# Altium schematic sheet Metroband 1.1 with changes - Sheet1.SchDoc: MetroBand - Main Circuit
size 292 x 193 mm; Title2: MetroBand; ENG_APP_DATE: --/--/--; DSN_APP_DATE: --/--/--; CHK_APP_DATE: --/--/--; Organization: team MOSFETS; Revision: 1.3; SheetNumber: 3; SheetTotal: 3
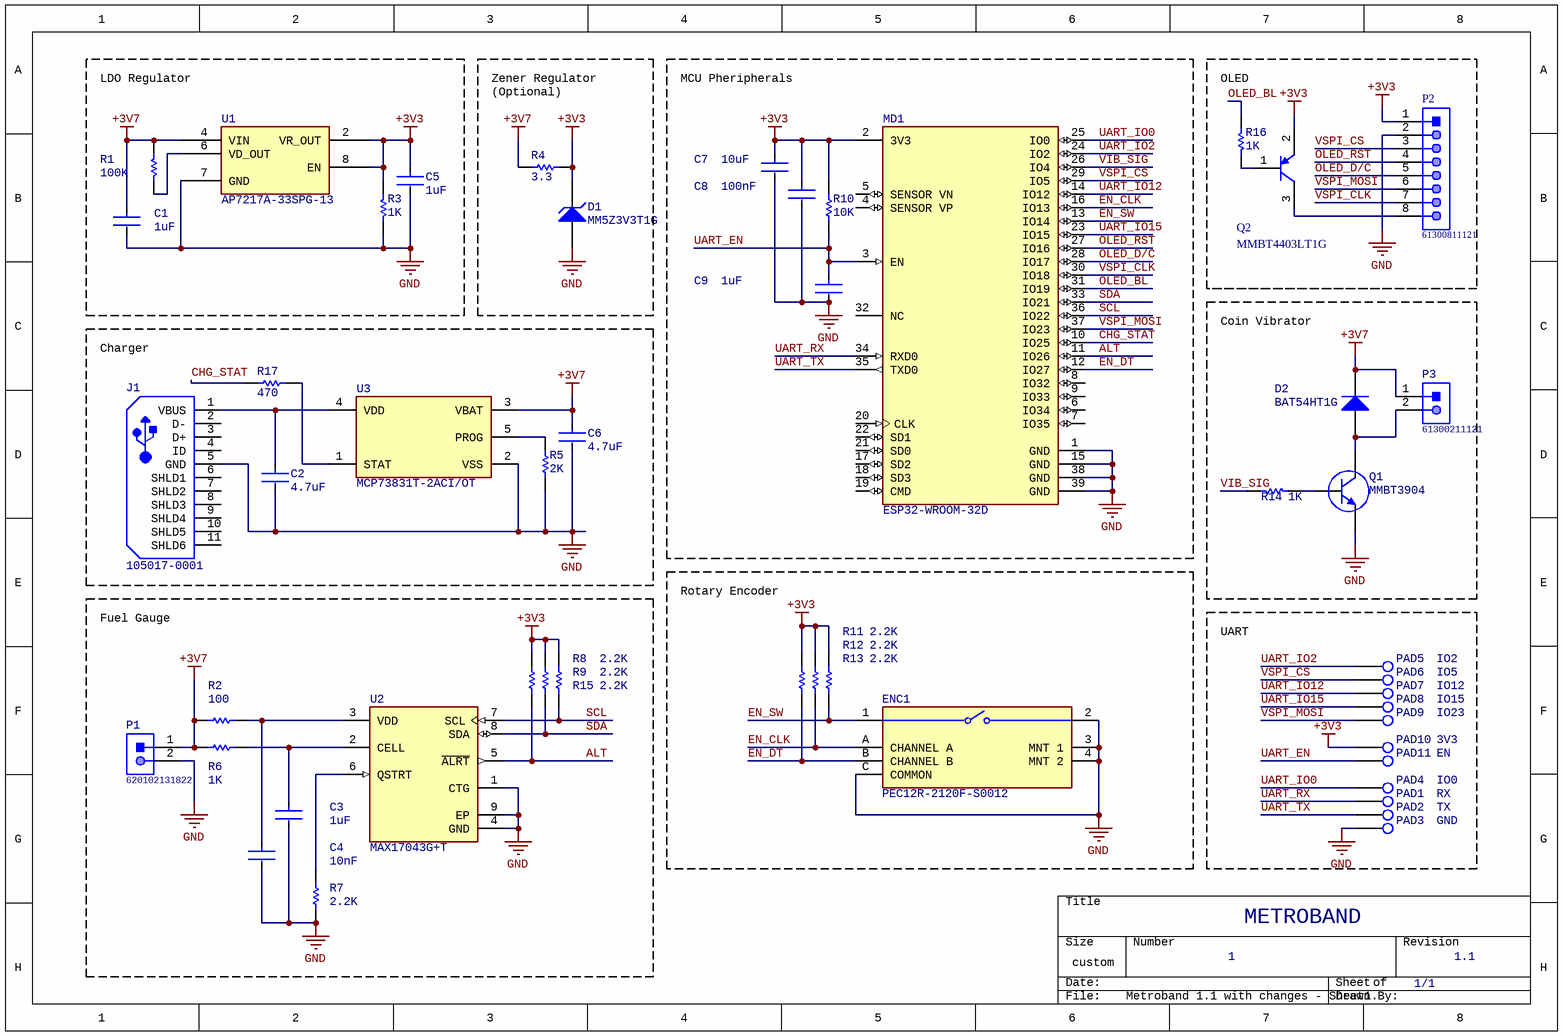
[diagram p0: Metroband 1.1 with changes - Sheet1.SchDoc]

## Parts
C1  1uF  [FP-GRM21B-0_15-IPC_C]
C2  4.7uF  [FP-GRM21B-0_15-IPC_C]
C3  1uF  [FP-GRM21B-0_15-IPC_C]
C4  10nF  [FP-GRM21B-0_15-IPC_C]
C5  1uF  [FP-GRM21B-0_15-IPC_C]
C6  4.7uF  [FP-GRM21B-0_15-IPC_C]
C7  10uF  [FP-GRM21B-0_15-IPC_C]
C8  100nF  [FP-GRM21B-0_15-IPC_C]
C9  1uF  [FP-GRM21B-0_15-IPC_C]
D1  MM5Z3V3T1G  [ONSC-SOD-523-2-502-01_V]
D2  BAT54HT1G  [ONSC-SOD-323-2-477-02_V]
ENC1  PEC12R-2120F-S0012  [FP-PEC12R-2120F-S0012-MFG]
J1  105017-0001  [USB-MICRO-B_V]
MD1  ESP32-WROOM-32D  [FP-ESP32-WROOM-32D-MFG]
P1  620102131822  [620102131822]
P2  61300811121  [61300811121]
P3  61300211121  [61300211121]
PAD1  RX  [PAD-Footprint-1]
PAD2  TX  [PAD-Footprint-1]
PAD3  GND  [PAD-Footprint-1]
PAD4  IO0  [PAD-Footprint-1]
PAD5  IO2  [PAD-Footprint-1]
PAD6  IO5  [PAD-Footprint-1]
PAD7  IO12  [PAD-Footprint-1]
PAD8  IO15  [PAD-Footprint-1]
PAD9  IO23  [PAD-Footprint-1]
PAD10  3V3  [PAD-Footprint-1]
PAD11  EN  [PAD-Footprint-1]
Q1  MMBT3904  [NXP-SOT23-3_V]
Q2  MMBT4403LT1G  [ONSC-SOT-23-3-318-08_V]
R1  100K  [RESC1609X50X30NL8T20]
R2  100  [RESC1609X50X30NL8T20]
R3  1K  [RESC1609X50X30NL8T20]
R4  3.3  [RESC1609X50X30NL8T20]
R5  2K  [RESC1609X50X30NL8T20]
R6  1K  [RESC1609X50X30NL8T20]
R7  2.2K  [RESC1609X50X30NL8T20]
R8  2.2K  [RESC1609X50X30NL8T20]
R9  2.2K  [RESC1609X50X30NL8T20]
R10  10K  [RESC1609X50X30NL8T20]
R11  2.2K  [RESC1609X50X30NL8T20]
R12  2.2K  [RESC1609X50X30NL8T20]
R13  2.2K  [RESC1609X50X30NL8T20]
R14  1K  [RESC1609X50X30NL8T20]
R15  2.2K  [RESC1609X50X30NL8T20]
R16  1K  [RESC1609X50X30NL8T20]
R17  470  [RESC1609X50X30NL8T20]
U1  AP7217A-33SPG-13  [AP7217A-33SPG-13-Footprint-1]
U2  MAX17043G+T  [FP-T823-1-MFG]
U3  MCP73831T-2ACI/OT  [FP-C04-091-OT-IPC_A]

## Blocks framed on the sheet
LDO Regulator: C1 C5 R1 R3 U1
MCU Pheripherals: C7-C9 MD1 R10
Coin Vibrator: D2 P3 Q1 R14
Charger: C2 C6 J1 R5 R17 U3
Fuel Gauge: C3 C4 P1 R2 R6-R9 R15 U2
Rotary Encoder: ENC1 R11-R13
UART: PAD1-PAD11

## Nets
+3V3: C5.1 C7.1 C8.1 D1.1(K) MD1.2(3V3) P2.1 PAD10.1 Q2.2(E) R3.2 R4.2 R8.2 R9.2 R10.2 R11.2 R12.2 R13.2 R15.2 U1.2(VR_OUT) U1.8(EN)
+3V7: C1.1 C6.1 D2.1(K) P1.1 P3.1 R1.2 R2.2 R4.1 R6.2 U1.4(VIN) U3.3(VBAT)
GND: C1.2 C2.2 C3.2 C4.2 C5.2 C6.2 C7.2 C8.2 C9.2 D1.2(A) ENC1.2 ENC1.3(MNT_1) ENC1.4(MNT_2) ENC1.C(COMMON) J1.5(GND) MD1.1(GND) MD1.15(GND) MD1.38(GND) MD1.39(GND) P1.2 P2.2 PAD3.1 Q1.2(E) R3.1 R5.1 R7.1 U1.7(GND) U2.1(CTG) U2.4(GND) U2.9(EP) U3.2(VSS)
ALT: MD1.11(IO26) R8.1 U2.5(~{ALRT})
CHG_STAT: MD1.10(IO25) R17.2
EN_CLK: ENC1.A(CHANNEL_A) MD1.16(IO13) R12.1
EN_DT: ENC1.B(CHANNEL_B) MD1.12(IO27) R11.1
EN_SW: ENC1.1 MD1.13(IO14) R13.1
OLED_BL: MD1.31(IO19) R16.2
OLED_D/C: MD1.28(IO17) P2.5
OLED_RST: MD1.27(IO16) P2.4
SCL: MD1.36(IO22) R15.1 U2.7(SCL)
SDA: MD1.33(IO21) R9.1 U2.8(SDA)
UART_EN: C9.1 MD1.3(EN) PAD11.1 R10.1
UART_IO0: MD1.25(IO0) PAD4.1
UART_IO2: MD1.24(IO2) PAD5.1
UART_IO12: MD1.14(IO12) PAD7.1
UART_IO15: MD1.23(IO15) PAD8.1
UART_RX: MD1.34(RXD0) PAD1.1
UART_TX: MD1.35(TXD0) PAD2.1
VIB_SIG: MD1.26(IO4) R14.2
VSPI_CLK: MD1.30(IO18) P2.7
VSPI_CS: MD1.29(IO5) P2.3 PAD6.1
VSPI_MOSI: MD1.37(IO23) P2.6 PAD9.1
NetC2_1: C2.1 J1.1(VBUS) U3.4(VDD)
NetC3_1: C3.1 R6.1 U2.2(CELL)
NetC4_1: C4.1 R2.1 U2.3(VDD)
NetD2_2: D2.2(A) P3.2 Q1.3(C)
NetP2_8: P2.8 Q2.3(C)
NetQ1_1: Q1.1(B) R14.1
NetQ2_1: Q2.1(B) R16.1
NetR1_1: R1.1 U1.6(VD_OUT)
NetR5_2: R5.2 U3.5(PROG)
NetR7_2: R7.2 U2.6(QSTRT)
NetR17_1: R17.1 U3.1(STAT)

Not connected (* = marked no-connect by the designer): J1 2(D-) 3(D+) 4(ID) 6(SHLD1) 7(SHLD2) 8(SHLD3) 9(SHLD4) 10(SHLD5) 11(SHLD6); MD1 4(SENSOR_VP) 5(SENSOR_VN) 6(IO34) 7(IO35) 8(IO32) 9(IO33) 17(SD2) 18(SD3) 19(CMD) 20(CLK) 21(SD0) 22(SD1) 32(NC)

## Notes on the sheet
- Zener Regulator
- (Optional)
- (near R16) OLED
- 1
- METROBAND
- 1/1
- 1.1
- THIS DOCUMENT AND THE DATA DISCLOSED HEREIN OR
- HEREWITH IS THE PROPERTY OF ALTIUM LIMITED AND MAY
- DWG NO:
- REVISION
- REV:
- DESCRIPTION
- DATE
- APPROVED
- BE FREELY DISTRIBUTED IN WHOLE. NO RIGHTS ARE
- RESERVED OR EXPRESS OR IMPLIED WARANTEE GIVEN.
- ENG:
- APPROVALS
- PROJECT
- DSN:
- CHK:
- REFERENCE DOCUMENTS
- PROJECT REVISION:
- TITLE
- DOCUMENT REVISION:
- DESIGN ITEM:
- BOM:
- FAB DWG:
- PCB DWG:
- ASSY DWG:
- SCALE:
- A3
- SIZE
- CAGE CODE
- FILE NAME
- DWG NO.
- SHEET
- OF
- REV

## Library data of the parts
C1 C5 = CMP-2007-03541-2: Chip Multilayer Ceramic Capacitors for General Purpose, 0805, 1uF, X5R, 15%, 10%, 25V; Length: 2mm; Depth: 1.25mm; Termination: SMD/SMT; Voltage: 25V; Height: 1.25mm; Material: Ceramic; Thickness: 0.053inch; Radiation Hardening: No; Min Operating Temperature: -55°C; Width: 0.049inch; Package Quantity: 1; Mount: Surface Mount; Dielectric: X5R; Packaging: Tape and Reel; Capacitance: 1uF; Voltage Rating (DC): 25V; Lead Free: Lead Free; Max Operating Temperature: 85°C; Case Code (Imperial): 0805; Case/Package: 0805; Tolerance: 10%; Voltage Rating: 25V; Case Code (Metric): 2012
C2 C6 = CMP-2007-03541-2: Chip Multilayer Ceramic Capacitors for General Purpose, 0805, 4.7uF, X5R, 15%, 10%, 25V; Capacitance: 10uF; Length: 2mm; Depth: 1.25mm; Termination: SMD/SMT; Voltage: 25V; Height: 1.25mm; Material: Ceramic; Thickness: 0.053inch; Radiation Hardening: No; Min Operating Temperature: -55°C; Width: 0.049inch; Package Quantity: 1; Mount: Surface Mount; Dielectric: X5R; Packaging: Tape and Reel; Voltage Rating (DC): 25V; Lead Free: Lead Free; Max Operating Temperature: 85°C; Case Code (Imperial): 0805; Case/Package: 0805; Tolerance: 10%; Voltage Rating: 25V; Case Code (Metric): 2012
C3 C9 = CMP-2007-03541-2: Chip Multilayer Ceramic Capacitors for General Purpose, 0805, 1uF, X5R, 15%, 10%, 25V; Capacitance: 10uF; Length: 2mm; Depth: 1.25mm; Termination: SMD/SMT; Voltage: 25V; Height: 1.25mm; Material: Ceramic; Thickness: 0.053inch; Radiation Hardening: No; Min Operating Temperature: -55°C; Width: 0.049inch; Package Quantity: 1; Mount: Surface Mount; Dielectric: X5R; Packaging: Tape and Reel; Voltage Rating (DC): 25V; Lead Free: Lead Free; Max Operating Temperature: 85°C; Case Code (Imperial): 0805; Case/Package: 0805; Tolerance: 10%; Voltage Rating: 25V; Case Code (Metric): 2012
C4 = CMP-2007-03541-2: Chip Multilayer Ceramic Capacitors for General Purpose, 0805, 10nF, X5R, 15%, 10%, 25V; Capacitance: 10uF; Length: 2mm; Depth: 1.25mm; Termination: SMD/SMT; Voltage: 25V; Height: 1.25mm; Material: Ceramic; Thickness: 0.053inch; Radiation Hardening: No; Min Operating Temperature: -55°C; Width: 0.049inch; Package Quantity: 1; Mount: Surface Mount; Dielectric: X5R; Packaging: Tape and Reel; Voltage Rating (DC): 25V; Lead Free: Lead Free; Max Operating Temperature: 85°C; Case Code (Imperial): 0805; Case/Package: 0805; Tolerance: 10%; Voltage Rating: 25V; Case Code (Metric): 2012
C7 = CMP-2007-03541-2: Chip Multilayer Ceramic Capacitors for General Purpose, 0805, 10uF, X5R, 15%, 10%, 25V; Length: 2mm; Depth: 1.25mm; Termination: SMD/SMT; Voltage: 25V; Height: 1.25mm; Material: Ceramic; Thickness: 0.053inch; Radiation Hardening: No; Min Operating Temperature: -55°C; Width: 0.049inch; Package Quantity: 1; Mount: Surface Mount; Dielectric: X5R; Packaging: Tape and Reel; Capacitance: 10uF; Voltage Rating (DC): 25V; Lead Free: Lead Free; Max Operating Temperature: 85°C; Case Code (Imperial): 0805; Case/Package: 0805; Tolerance: 10%; Voltage Rating: 25V; Case Code (Metric): 2012
C8 = CMP-2007-03541-2: Chip Multilayer Ceramic Capacitors for General Purpose, 0805, 100nF, X5R, 15%, 10%, 25V; Capacitance: 10uF; Length: 2mm; Depth: 1.25mm; Termination: SMD/SMT; Voltage: 25V; Height: 1.25mm; Material: Ceramic; Thickness: 0.053inch; Radiation Hardening: No; Min Operating Temperature: -55°C; Width: 0.049inch; Package Quantity: 1; Mount: Surface Mount; Dielectric: X5R; Packaging: Tape and Reel; Voltage Rating (DC): 25V; Lead Free: Lead Free; Max Operating Temperature: 85°C; Case Code (Imperial): 0805; Case/Package: 0805; Tolerance: 10%; Voltage Rating: 25V; Case Code (Metric): 2012
D1 = CMP-1060-00750-1: Zener Voltage Regulator, 500 mW, 2-Pin SOD-523, Pb-Free, Tape and Reel; Manufacturer: On Semiconductor; P Max (W): 0.5; VZ Typ (V): 3.3; RoHS: Pb-Free; ComponentLink2Description: Datasheet; PackageReference: SOD-523-2-502-01; DatasheetVersion: Rev. 10; ComponentLink1Description: Manufacturer URL; PackageVersion: Rev. E, 09/2010; ComponentLink3URL: http://www.onsemi.com/pub_link/Collateral/502-01.PDF; ComponentLink2URL: http://www.onsemi.cn/pub_link/Collateral/MM5Z2V4T1-D.PDF; Mounting Technology: Surface Mount; PartNumber: MM5Z3V3T1G; Packing: Tape and Reel; PackageDescription: 2-Pin SOD, Body 1.2 x 0.8 mm; ComponentLink1URL: http://www.onsemi.com/; ComponentLink3Description: Package Specification
D2 = CMP-1055-00462-1: Schottky Barrier Diode, 2-Pin SOD-323, Pb-Free, Tape and Reel; Manufacturer: On Semiconductor; Configuration: Single; trr Max (ns): 5; IFSM Max (A): 0.6; ComponentLink3URL: http://www.onsemi.com/pub_link/Collateral/477-02.PDF.1; PackageDescription: 2-Pin SOD, Body 1.7 x 1.25 mm; ComponentLink2URL: http://www.onsemi.cn/pub_link/Collateral/BAT54HT1-D.PDF; ComponentLink3Description: Package Specification; ComponentLink2Description: Datasheet; DatasheetVersion: Rev. 6; PackageReference: SOD-323-2-477-02; RoHS: TRUE; ComponentLink1URL: http://www.onsemi.com/; Packing: Tape and Reel; PartNumber: BAT54HT1G; Mounting Technology: Surface Mount; ComponentLink1Description: Manufacturer URL; PackageVersion: Rev. H, 03/2007
ENC1 = CMP-07421-000025-1: ROTARY ENCODER MECHANICAL 12PPR; Pulses per Revolution: 12; Hole Diameter: 2.1mm; Output Type: Quadrature; Built in Switch: Yes; Number of Channels: 2; Termination: PC Pin; Encoder Type: Mechanical; Package Quantity: 75; Height: 13.4mm; Max Operating Temperature: 70°C; Series: PEC12R; RoHS Compliant: Yes; Orientation: Right Angle; Length: 26mm; Width: 12.5mm; Mount: Through Hole; Packaging: Bulk; Detent: Yes; Min Operating Temperature: -30°C
J1 = CMP-2000-05827-1: Micro-USB B Receptacle, Right Angle, Bottom Mount, Surface Mount, with Solder Tabs, -30 to 85 degC, 5-Pin USB, RoHS, Tape and Reel; Manufacturer: Molex; Featured Product: Micro-USBConnectorsUSBConnectors; Other Names: WM1399DKR; Package Version: Rev. F, 12/2012; Number of Contacts: 5; Connector Type: USB-microB; Catalog Drawings: 1050170001; 3D Model: 105017-0001.stp; Mating Products: WM17145-ND-CABLEMICROUSBBTOSTDA1.0MWM17147-ND-CABLEMICROUSBBTOSTDA2.0MWM17146-ND-CABLEMICROUSBBTOSTDA1.5M; PCN Assembly/Origin: ResinSupplier21/Oct/2015; Voltage - Max: 30V; Online Catalog: Molex-MicroUSB; Manufacturer URL: http://www.molex.com/; Package Description: 5-Leads USB, Micro B, Body 7.5 x 5 mm, Pitch 0.65 mm; Datasheet URL: http://www.molex.com/elqNow/elqRedir.htm?ref=http://www.molex.com/webdocs/datasheets/pdf/en-us/1050170001_IO_CONNECTORS.pdf; Ingress Protection: -; Datasheet Version: 03/2016; Mounting Type: BoardCutout,SurfaceMount,RightAngle; Circuits: 5; Standard Package: 1; Package Reference: MICRO-B; Package URL: http://www.molex.com/pdm_docs/sd/1050170001_sd.pdf; Category: Connectors,Interconnects; Series: -; RoHS Information: 1050170001CertofCompliance; Features: Shielded,SolderRetention; Family: USB,DVI,HDMIConnectors; Specifications: -; Gender: Receptacle; Packaging: Digi-Reel®; Mounting Technology: SurfaceMount
MD1 = CMP-194065-000003-1: WIFI MODULE 32MBITS SPI FLASH; Manufacturer: Espressif Systems; Max Supply Voltage: 3.6V; Nominal Supply Current: 500mA; Max Frequency: 2484MHz; Number Of Adc Channels: 16; Number Of Gpio: 32; Interface: I2C,SPI,UART,Ethernet,I2S,Other; Data Rate: 150Mbits/s; Min Supply Voltage: 3V; Bandwidth: 72MHz; Sensitivity: -98dBm; Octopart: https://octopart.com/esp32-wroom-32d-espressif+systems-91040050; Package: ESP32-WROOM-32D; ComponentLink2URL: https://www.espressif.com/sites/default/files/documentation/esp32-wroom-32d_esp32-wroom-32u_datasheet_en.pdf; Lead Free: Yes; Category: UNK; Mouser Description: Wi-Fi/BT BLE Module ESP32-D0WD, SPI Flash, UART, P; Device Class L1: Integrated Circuits (ICs); RoHS: TRUE; Temperature Range Low: -40°C; ComponentLink2Description: Datasheet; Digikey Description: WIFI MODULE 32MBITS SPI FLASH; Height: 3.2mm; Temperature: -40°C to +85°C; Manufacturer Part Number: ESP32-WROOM-32D; Device Class L3: Transceivers; Device Class L2: RF Semiconductors and Devices; Temperature Range High: +85°C; Automotive: No
P1 = CMP-1502-00669-1: Male Shrouded Header WR-WTB, SMT, Right Angled, pitch 2 mm, 1 x 2 position; Manufacturer: Wurth Elektronik; Position: 1x2; Working Voltage: 100VAC; Contact Resistance: 20mOhm; Pitch: 2mm; Packaging: TapeandReel; Part Number: 620102131822; Publisher: WurthElektronik; Mounting Technology: SMT; Manufacturer URL: http://www.we-online.de; Datasheet URL: https://katalog.we-online.de/em/datasheet/6201xx131822.pdf; Gender: Male; Operating Temperature: -25to85degC; Package Reference: 620102131822; Orientation: RightAngled
P2 = CMP-1502-01076-1: THT Vertical Pin Header WR-PHD, Pitch 2.54 mm, Single Row, 8 pins; Manufacturer: Wurth Elektronik; Rated Current: 3A; Pin Number: 8; Working Voltage: 250VAC; Gender: Male; Contact Resistance: 20mOhm; Pitch: 2.54mm; Withstanding Voltage: 500VAC; Publisher: WurthElektronik; Operating Temperature: -40to105degC; Orientation: Vertical; Row Number: Single; Part Number: 61300811121; Package Reference: 61300811121; Mounting Technology: THT; Packaging: Bag; Manufacturer URL: http://www.we-online.de; Datasheet URL: https://katalog.we-online.de/em/datasheet/6130xx11121.pdf
P3 = CMP-1712-00002-4: THT Vertical Pin Header WR-PHD, Pitch 2.54 mm, Single Row, 2 pins; Manufacturer: Wurth Elektronik; Rated Current: 3A; Gender: Male; Withstanding Voltage: 500VAC; Working Voltage: 250VAC; Pitch: 2.54mm; Contact Resistance: 20mOhm; Pin Number: 2; Mounting Technology: THT; Orientation: Vertical; Operating Temperature: -40to105degC; Packaging: Bag; Publisher: WurthElektronik; Datasheet URL: https://katalog.we-online.de/em/datasheet/6130xx11121.pdf; Manufacturer URL: http://www.we-online.de; Row Number: Single; Package Reference: 61300211121; Part Number: 61300211121
PAD1-PAD11 = CMP-00000-3: Wirepad
Q1 = CMP-013-00034-1: TRANSISTOR, NPN, REEL 3K
Q2 = CMP-1048-00539-1: Switching Transistor, PNP Silicon, 3-Pin SOT-23, Pb-Free, Tape and Reel; Manufacturer: On Semiconductor; fT Min (MHz): 200; IC Continuous (A): -0.6; ComponentLink1URL: http://www.onsemi.com/; ComponentLink2URL: http://www.onsemi.cn/pub_link/Collateral/MMBT4403LT1-D.PDF; PackageVersion: Rev. AP, 11/2009; ComponentLink1Description: Manufacturer URL; PackageDescription: 3-Pin Small Outline Transistor, Body 2.92 x 1.3 mm, Pitch 0.95 mm; Polarity: PNP; ComponentLink3Description: Package Specification; DatasheetVersion: Rev. 12; Mounting Technology: Surface Mount; PackageReference: SOT-23-3-318-08; ComponentLink3URL: http://www.onsemi.cn/pub_link/Collateral/318-08.PDF; Packing: Tape and Reel; PartNumber: MMBT4403LT1G; RoHS: TRUE; ComponentLink2Description: Datasheet
R1 = CMP-2000-03816-5: Chip Resistor, 100K Ohm, Jumper, 100 mW, -55 to 155 degC, 0603 (1608 Metric), RoHS, Tape and Reel; Manufacturer: Vishay Semiconductor; Voltage Rating: 75 V; Package Quantity: 5000; DatasheetVersion: 06/2012; Min Operating Temperature: -55 degC; ComponentLink1URL: http://www.vishay.com/; Mounting Technology: Surface Mount; Height: 0.45 mm; ComponentLink1Description: Manufacturer URL; REACH SVHC: Unknown; PackageReference: 0603; Packaging: Tape and Reel; Max Operating Temperature: 155 degC; Mount: Surface Mount; ComponentLink2Description: Datasheet; PackageDescription: 2-Pin Surface Mount Device, Body 1.575 x 0.85 mm; Length: 1.55 mm; ComponentLink2URL: http://www.vishay.com/docs/20035/dcrcwe3.pdf; Pins: 2; RoHSCompliant: true
R2 = CMP-2000-03816-5: Chip Resistor, 100 Ohm, Jumper, 100 mW, -55 to 155 degC, 0603 (1608 Metric), RoHS, Tape and Reel; Manufacturer: Vishay Semiconductor; Voltage Rating: 75 V; Package Quantity: 5000; DatasheetVersion: 06/2012; Min Operating Temperature: -55 degC; ComponentLink1URL: http://www.vishay.com/; Mounting Technology: Surface Mount; Height: 0.45 mm; ComponentLink1Description: Manufacturer URL; REACH SVHC: Unknown; PackageReference: 0603; Packaging: Tape and Reel; Max Operating Temperature: 155 degC; Mount: Surface Mount; ComponentLink2Description: Datasheet; PackageDescription: 2-Pin Surface Mount Device, Body 1.575 x 0.85 mm; Length: 1.55 mm; ComponentLink2URL: http://www.vishay.com/docs/20035/dcrcwe3.pdf; Pins: 2; RoHSCompliant: true
R3 R6 R14 R16 = CMP-2000-03816-5: Chip Resistor, 1K Ohm, Jumper, 100 mW, -55 to 155 degC, 0603 (1608 Metric), RoHS, Tape and Reel; Manufacturer: Vishay Semiconductor; Voltage Rating: 75 V; Package Quantity: 5000; DatasheetVersion: 06/2012; Min Operating Temperature: -55 degC; ComponentLink1URL: http://www.vishay.com/; Mounting Technology: Surface Mount; Height: 0.45 mm; ComponentLink1Description: Manufacturer URL; REACH SVHC: Unknown; PackageReference: 0603; Packaging: Tape and Reel; Max Operating Temperature: 155 degC; Mount: Surface Mount; ComponentLink2Description: Datasheet; PackageDescription: 2-Pin Surface Mount Device, Body 1.575 x 0.85 mm; Length: 1.55 mm; ComponentLink2URL: http://www.vishay.com/docs/20035/dcrcwe3.pdf; Pins: 2; RoHSCompliant: true
R4 = CMP-2000-03816-5: Chip Resistor, 3.3 Ohm, Jumper, 100 mW, -55 to 155 degC, 0603 (1608 Metric), RoHS, Tape and Reel; Manufacturer: Vishay Semiconductor; Voltage Rating: 75 V; Package Quantity: 5000; DatasheetVersion: 06/2012; Min Operating Temperature: -55 degC; ComponentLink1URL: http://www.vishay.com/; Mounting Technology: Surface Mount; Height: 0.45 mm; ComponentLink1Description: Manufacturer URL; REACH SVHC: Unknown; PackageReference: 0603; Packaging: Tape and Reel; Max Operating Temperature: 155 degC; Mount: Surface Mount; ComponentLink2Description: Datasheet; PackageDescription: 2-Pin Surface Mount Device, Body 1.575 x 0.85 mm; Length: 1.55 mm; ComponentLink2URL: http://www.vishay.com/docs/20035/dcrcwe3.pdf; Pins: 2; RoHSCompliant: true
R5 R17 = CMP-2000-03816-5: Chip Resistor, 2K Ohm, Jumper, 100 mW, -55 to 155 degC, 0603 (1608 Metric), RoHS, Tape and Reel; Manufacturer: Vishay Semiconductor; Voltage Rating: 75 V; Package Quantity: 5000; DatasheetVersion: 06/2012; Min Operating Temperature: -55 degC; ComponentLink1URL: http://www.vishay.com/; Mounting Technology: Surface Mount; Height: 0.45 mm; ComponentLink1Description: Manufacturer URL; REACH SVHC: Unknown; PackageReference: 0603; Packaging: Tape and Reel; Max Operating Temperature: 155 degC; Mount: Surface Mount; ComponentLink2Description: Datasheet; PackageDescription: 2-Pin Surface Mount Device, Body 1.575 x 0.85 mm; Length: 1.55 mm; ComponentLink2URL: http://www.vishay.com/docs/20035/dcrcwe3.pdf; Pins: 2; RoHSCompliant: true
R7 = CMP-2000-03816-5: Chip Resistor, 0 Ohm, Jumper, 100 mW, -55 to 155 degC, 0603 (1608 Metric), RoHS, Tape and Reel; Manufacturer: Vishay Semiconductor; Voltage Rating: 75 V; Package Quantity: 5000; DatasheetVersion: 06/2012; Min Operating Temperature: -55 degC; ComponentLink1URL: http://www.vishay.com/; Mounting Technology: Surface Mount; Height: 0.45 mm; ComponentLink1Description: Manufacturer URL; REACH SVHC: Unknown; PackageReference: 0603; Packaging: Tape and Reel; Max Operating Temperature: 155 degC; Mount: Surface Mount; ComponentLink2Description: Datasheet; PackageDescription: 2-Pin Surface Mount Device, Body 1.575 x 0.85 mm; Length: 1.55 mm; ComponentLink2URL: http://www.vishay.com/docs/20035/dcrcwe3.pdf; Pins: 2; RoHSCompliant: true
R8 R9 R11-R13 R15 = CMP-2000-03816-5: Chip Resistor, 2.2K Ohm, Jumper, 100 mW, -55 to 155 degC, 0603 (1608 Metric), RoHS, Tape and Reel; Manufacturer: Vishay Semiconductor; Voltage Rating: 75 V; Package Quantity: 5000; DatasheetVersion: 06/2012; Min Operating Temperature: -55 degC; ComponentLink1URL: http://www.vishay.com/; Mounting Technology: Surface Mount; Height: 0.45 mm; ComponentLink1Description: Manufacturer URL; REACH SVHC: Unknown; PackageReference: 0603; Packaging: Tape and Reel; Max Operating Temperature: 155 degC; Mount: Surface Mount; ComponentLink2Description: Datasheet; PackageDescription: 2-Pin Surface Mount Device, Body 1.575 x 0.85 mm; Length: 1.55 mm; ComponentLink2URL: http://www.vishay.com/docs/20035/dcrcwe3.pdf; Pins: 2; RoHSCompliant: true
R10 = CMP-2000-03816-5: Chip Resistor, 10K Ohm, Jumper, 100 mW, -55 to 155 degC, 0603 (1608 Metric), RoHS, Tape and Reel; Manufacturer: Vishay Semiconductor; Voltage Rating: 75 V; Package Quantity: 5000; DatasheetVersion: 06/2012; Min Operating Temperature: -55 degC; ComponentLink1URL: http://www.vishay.com/; Mounting Technology: Surface Mount; Height: 0.45 mm; ComponentLink1Description: Manufacturer URL; REACH SVHC: Unknown; PackageReference: 0603; Packaging: Tape and Reel; Max Operating Temperature: 155 degC; Mount: Surface Mount; ComponentLink2Description: Datasheet; PackageDescription: 2-Pin Surface Mount Device, Body 1.575 x 0.85 mm; Length: 1.55 mm; ComponentLink2URL: http://www.vishay.com/docs/20035/dcrcwe3.pdf; Pins: 2; RoHSCompliant: true
U1 = CMP-019-00049-2: Fixed Positive LDO Regulator, 3.3V, 0.9V Dropout, CMOS, PDSO8
U2 = CMP-05715-000066-1: IC 2-WIRE FG MODEL GAUGE LO BATT; Manufacturer: Maxim; Max Supply Voltage: 4.5V; Standoff Height: 0mm; Nominal Supply Current: 50uA; Min Supply Voltage: 2.5V; Number Of Cells: 1; Height: 0.8mm; Device Class L3: Battery Management; Package: T823-1; Footprint Url: https://pdfserv.maximintegrated.com/land_patterns/90-0091.PDF; ComponentLink2Description: Datasheet; Lead Free: Yes; RoHS: TRUE; Mouser Description: Battery Management Over Volt Protector Ideal Diode; Digikey Description: IC 2-WIRE FG MODEL GAUGE LO BATT; Device Class L1: Integrated Circuits (ICs); Manufacturer Part Number: MAX17043G+T; Temperature: -20°C to +70°C; Automotive: No; ComponentLink2URL: https://datasheets.maximintegrated.com/en/ds/MAX17043-MAX17044.pdf; Device Class L2: Power Management ICs; Octopart: https://octopart.com/max17043g%2Bt-maxim+integrated-43979038; Category: IC; Temperature Range High: +70°C; Temperature Range Low: -20°C
U3 = CMP-0133-00143-2: IC CONTROLLR LI-ION 4.2V SOT23-5; Max Power Dissipation: 1.54W; Output Current: 500mA; Max Output Voltage: 4.5V; Number of Outputs: 1; Min Output Voltage: 4.168V; Min Supply Voltage: 3.75V; Max Input Voltage: 6V; Voltage Rating: 4.534V; Drain to Source Resistance: 350mR; Max Operating Temperature: 85°C; Length: 0.122inch; Number of Pins: 5; REACH SVHC: No SVHC; Radiation Hardening: No; Min Operating Temperature: -40°C; Weight: 0.00709oz; Contact Plating: Tin; Termination: SMD/SMT; Case/Package: SOT-23; Mount: Surface Mount; Width: 0.071inch; Packaging: Tape and Reel; Number of Cells: 1; Max Charge Current: 500mA; Height: 0.051inch; Number of Channels: 1; Output Voltage: 4.2V; Max Supply Voltage: 6V; Lead Free: Lead Free